# EAGLE design WW-11 (EAGLE 6.5.0)
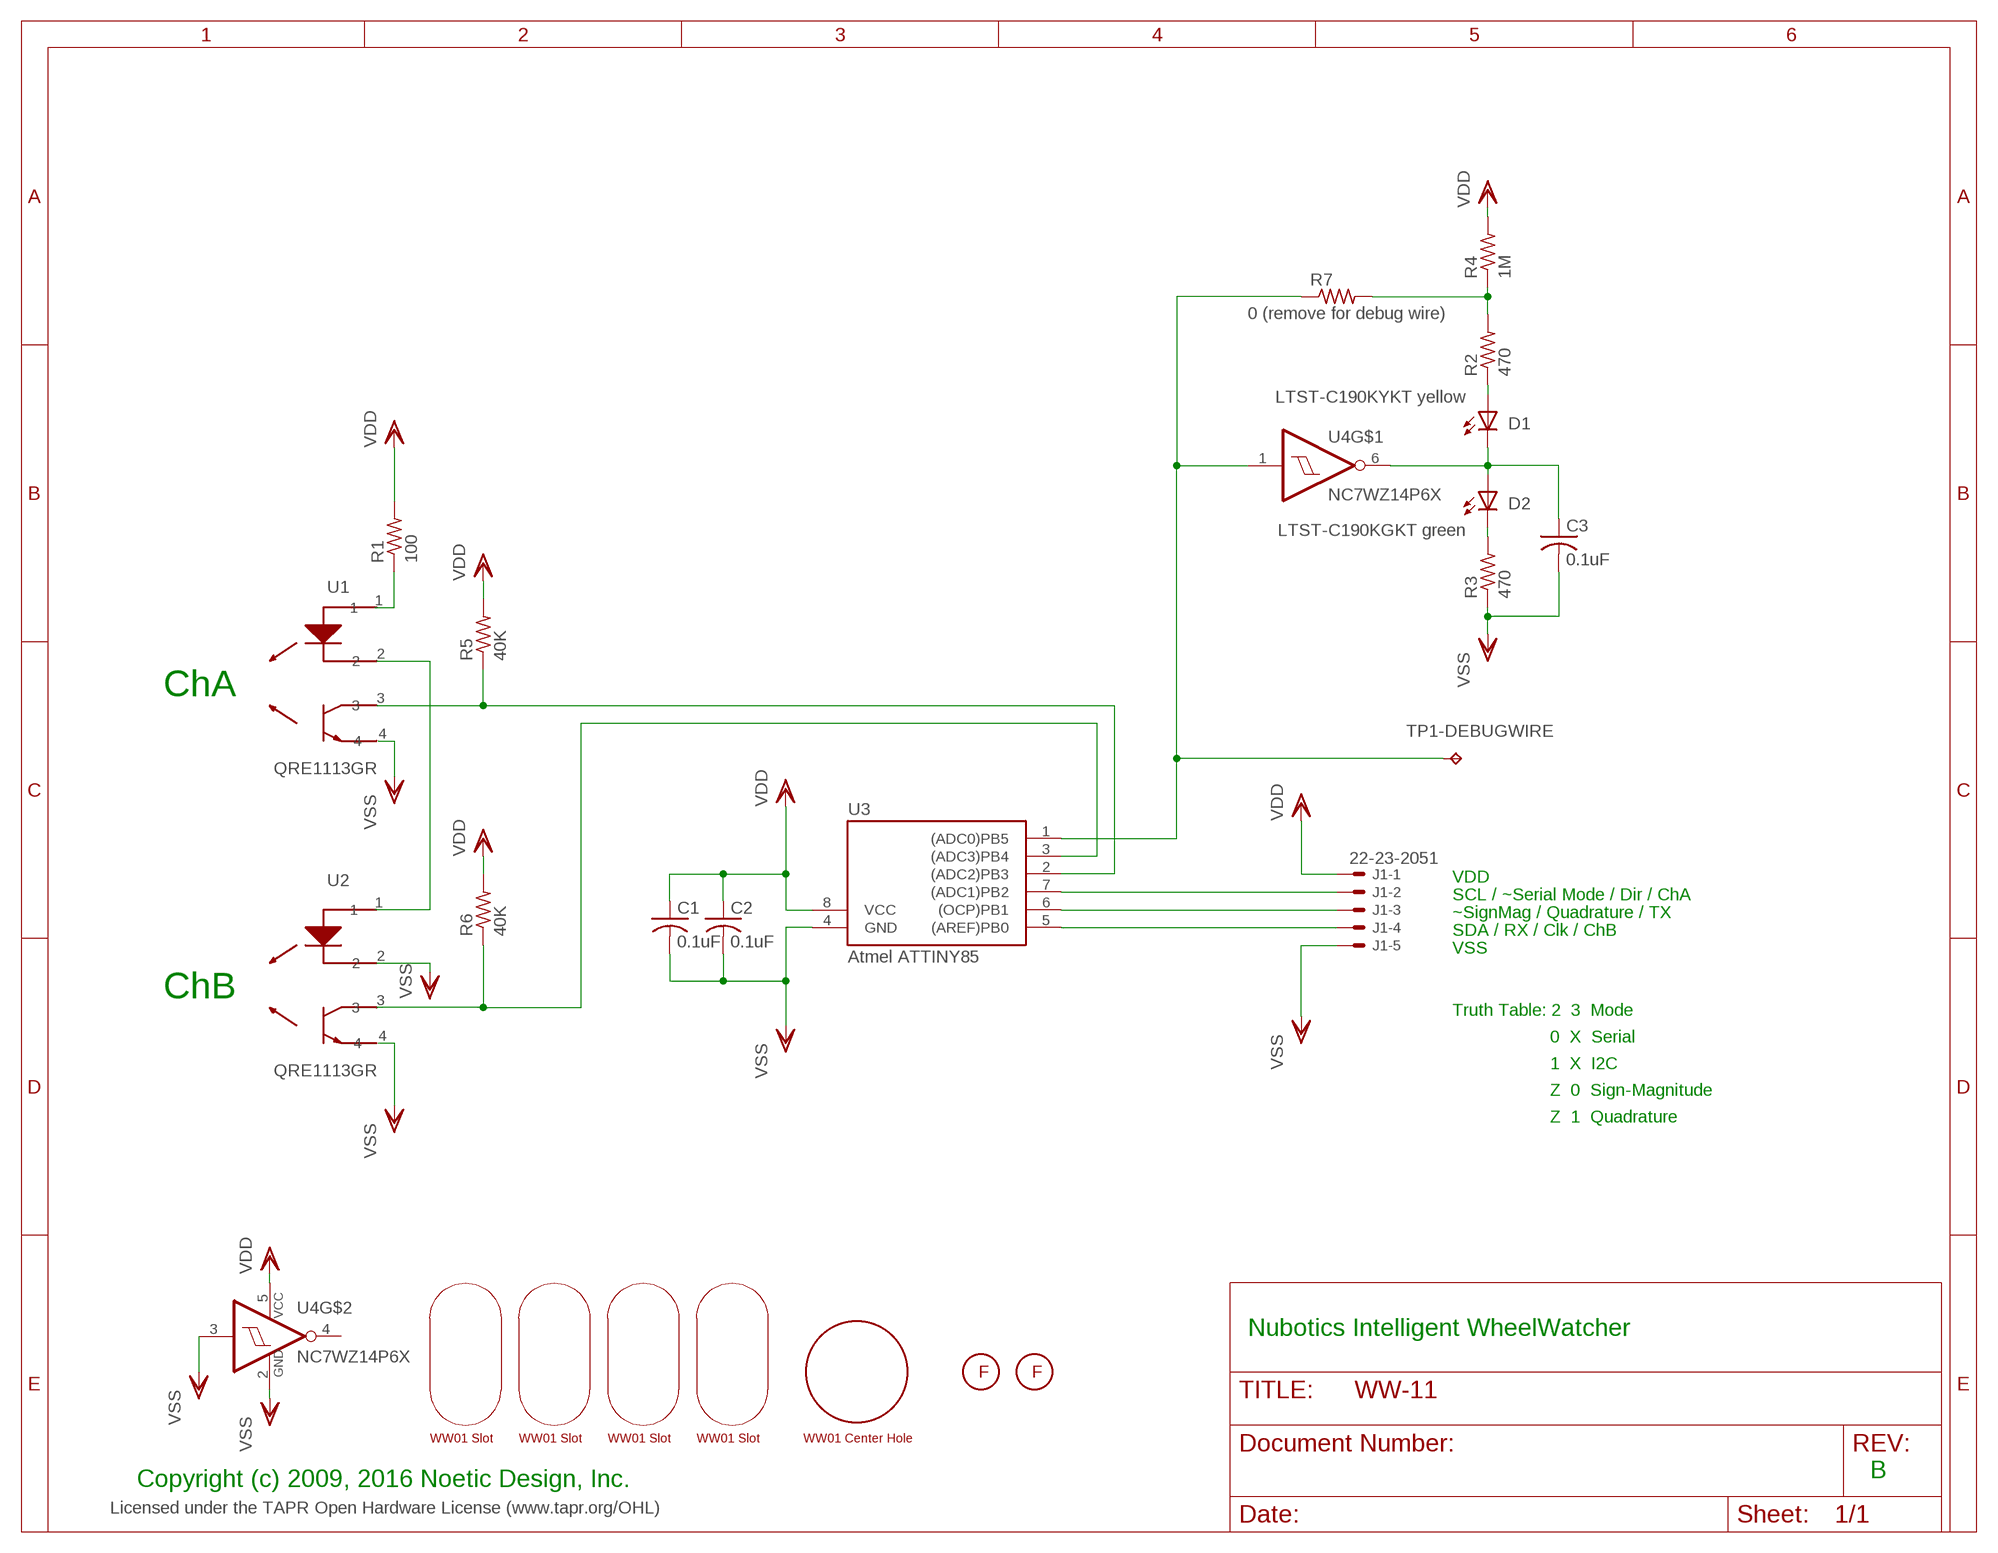
[diagram p0: schematic, sheet 1]

## Parts
C1  0.1uF  C-USC0603  [C0603]
C2  0.1uF  C-USC0603  [C0603]
C3  0.1uF  C-USC0603  [C0603]
D1  LTST-C190KYKT yellow  LEDCHIP-LED0603  [CHIP-LED0603]
D2  LTST-C190KGKT green  LEDCHIP-LED0603  [CHIP-LED0603]
FM1  FIDUCIAL2MMCIRCLE  [FIDUCIAL_2MMCIRCLE]
FM2  FIDUCIAL2MMCIRCLE  [FIDUCIAL_2MMCIRCLE]
J1  22-23-2051  [22-23-2051]
R1  100  R-US_R0603  [R0603]
R2  470  R-US_R0603  [R0603]
R3  470  R-US_R0603  [R0603]
R4  1M  R-US_R0603  [R0603]
R5  40K  R-US_R0603  [R0603]
R6  40K  R-US_R0603  [R0603]
R7  0 (remove for debug wire)  R-US_R0603  [R0603]
TP1-DEBUGWIRE  DEBUG WIRE  TPB1,27  [B1,27]
U1  QRE1113GR  [4TSOP]
U2  QRE1113GR  [4TSOP]
U3  Atmel ATTINY85  TINY85S  [SOIC8]
U4  NC7WZ14P6X  [SOT65P210X110-6AN_SC88_SC70-6]
U$1  WW-01SLOT  [WW01-SLOT]
U$2  WW-01SLOT  [WW01-SLOT]
U$3  WW-01SLOT  [WW01-SLOT]
U$4  WW-01SLOT  [WW01-SLOT]
U$5  WW01-CENTER  [WW01-CENTER]

## Nets
N$1: U1.2 U2.1
N$2: R1.1 U1.1
N$3: R5.1 U1.3 U3.2((ADC2)PB3)
N$4: R6.1 U2.3 U3.3((ADC3)PB4)
N$5: D1.A R2.1
N$6: C3.1 D1.C D2.A U4.6(O)
N$7: D2.C R3.2
N$9: R2.2 R4.1 R7.2
N$10: J1.2 U3.7((ADC1)PB2)
N$11: R7.1 TP1-DEBUGWIRE.PP(TP) U3.1((ADC0)PB5) U4.1(I)
N$12: J1.3 U3.6((OCP)PB1)
N$13: J1.4 U3.5((AREF)PB0)
VDD: C1.1 C2.1 J1.1 R1.2 R4.2 R5.2 R6.2 U3.8(VCC) U4.5(VCC)
VSS: C1.2 C2.2 C3.2 J1.5 R3.1 U1.4 U2.2 U2.4 U3.4(GND) U4.2(GND) U4.3(I)
Unconnected: U4.4(O)

## Notes on the sheet
- ChA
- VDD
- SCL / ~Serial Mode / Dir / ChA
- ~SignMag / Quadrature / TX
- SDA / RX / Clk / ChB
- VSS
- ChB
- Truth Table: 2  3  Mode
- 0  X  Serial
- 1  X  I2C
- Z  0  Sign-Magnitude
- Z  1  Quadrature
- Nubotics Intelligent WheelWatcher
- B
- Copyright (c) 2009, 2016 Noetic Design, Inc.
- Licensed under the TAPR Open Hardware License (www.tapr.org/OHL)

## Library data of the parts
C1 C2 = resistor:C-US: CAPACITOR, American symbol
C3 = rcl:C-US: CAPACITOR, American symbol
D1 D2 = led:LED: LED OSRAM: - CHIPLED LG R971, LG N971, LY N971, LG Q971, LY Q971, LO R971, LY R971 LH N974, LH R974 LS Q976, LO Q976, LY Q976 LO Q996 - Hyper CHIPLED LW Q18S LB Q993, LB Q99A, LB R99A - SideLED LS A670, LO A670, LY A670, LG A670, LP A670 LB A673, LV A673, LT A673, LW A673 LH A674 LY A675 LS A676, LA A676, LO A676, LY A676, LW A676 LS A679, LY A679, LG A679 - Hyper Micro SIDELED® LS Y876, LA Y876, LO Y876, LY Y876 LT Y87S - SmartLED LW L88C, LW L88S LB L89C, LB L89S, LG L890 LS L89K, LO L89K, LY L89K LS L896, LA L896, LO L896, LY L896 - TOPLED LS T670, LO T670, LY T670, LG T670, LP T670 LSG T670, LSP T670, LSY T670, LOP T670, LYG T670 LG T671, LOG T671, LSG T671 LB T673, LV T673, LT T673, LW T673 LH T674 LS T676, LA T676, LO T676, LY T676, LB T676, LH T676, LSB T676, LW T676 LB T67C, LV T67C, LT T67C, LS T67K, LO T67K, LY T67K, LW E67C LS E67B, LA E67B, LO E67B, LY E67B, LB E67C, LV E67C, LT E67C LW T67C LS T679, LY T679, LG T679 LS T770, LO T770, LY T770, LG T770, LP T770 LB T773, LV T773, LT T773, LW T773 LH T774 LS E675, LA E675, LY E675, LS T675 LS T776, LA T776, LO T776, LY T776, LB T776 LHGB T686 LT T68C, LB T68C - Hyper Mini TOPLED® LB M676 - Mini TOPLED Santana® LG M470 LS M47K, LO M47K, LY M47K Source: http://www.osram.convergy.de LUXEON: - LUMILED® LXK2-PW12-R00, LXK2-PW12-S00, LXK2-PW14-U00, LXK2-PW14-V00 LXK2-PM12-R00, LXK2-PM12-S00, LXK2-PM14-U00 LXK2-PE12-Q00, LXK2-PE12-R00, LXK2-PE12-S00, LXK2-PE14-T00, LXK2-PE14-U00 LXK2-PB12-K00, LXK2-PB12-L00, LXK2-PB12-M00, LXK2-PB14-N00, LXK2-PB14-P00, LXK2-PB14-Q00 LXK2-PR12-L00, LXK2-PR12-M00, LXK2-PR14-Q00, LXK2-PR14-R00 LXK2-PD12-Q00, LXK2-PD12-R00, LXK2-PD12-S00 LXK2-PH12-R00, LXK2-PH12-S00 LXK2-PL12-P00, LXK2-PL12-Q00, LXK2-PL12-R00 Source: www.luxeon.com KINGBRIGHT: KA-3528ASYC Source: www.kingbright.com
FM1 FM2 = pickplace:FIDUCIAL: Fiducial marks
J1 = con-molex:22-23-2051: .100" (2.54mm) Center Header - 5 Pin
R1-R3 R5 R6 = resistor:R-US_: RESISTOR, American symbol
R4 R7 = rcl:R-US_: RESISTOR, American symbol
TP1-DEBUGWIRE = testpad:TP: Test pad
U1 U2 = noetic:QRE1113GR: Fairchild Semiconductor QRE1113GR SMT Reflective Object Sensor Gull wing SMT 03-0261; PARTNUMBER: 03-0261
U3 = atmel:TINY85: MICROCONTROLLER 2.7-5.5 V 8 Kbytes FLASH 512 bytes EEPROM 512 bytes RAM 4-channel 10 bit ADC
U4 = fairchild-tinylogic:NC7W*14
U$1-U$4 = noetic:WW-01SLOT
U$5 = noetic:WW01-CENTER

## Net classes
0 default: width 0.203 mm, drill 0.203 mm, clearance 0.229 mm

## Board
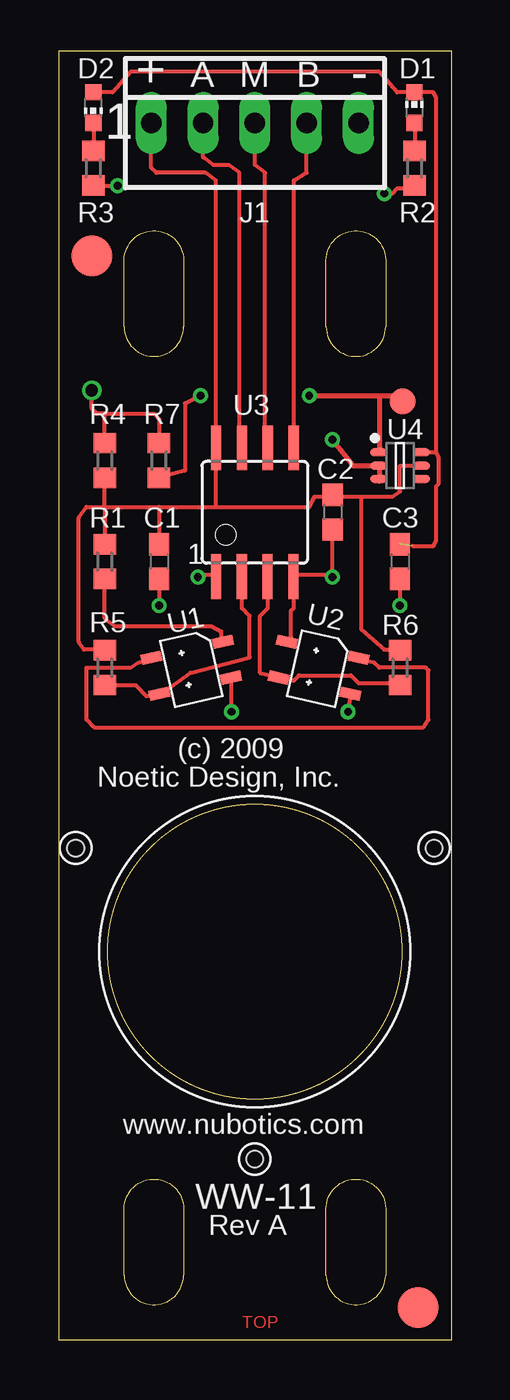
[diagram p1: board, top side]
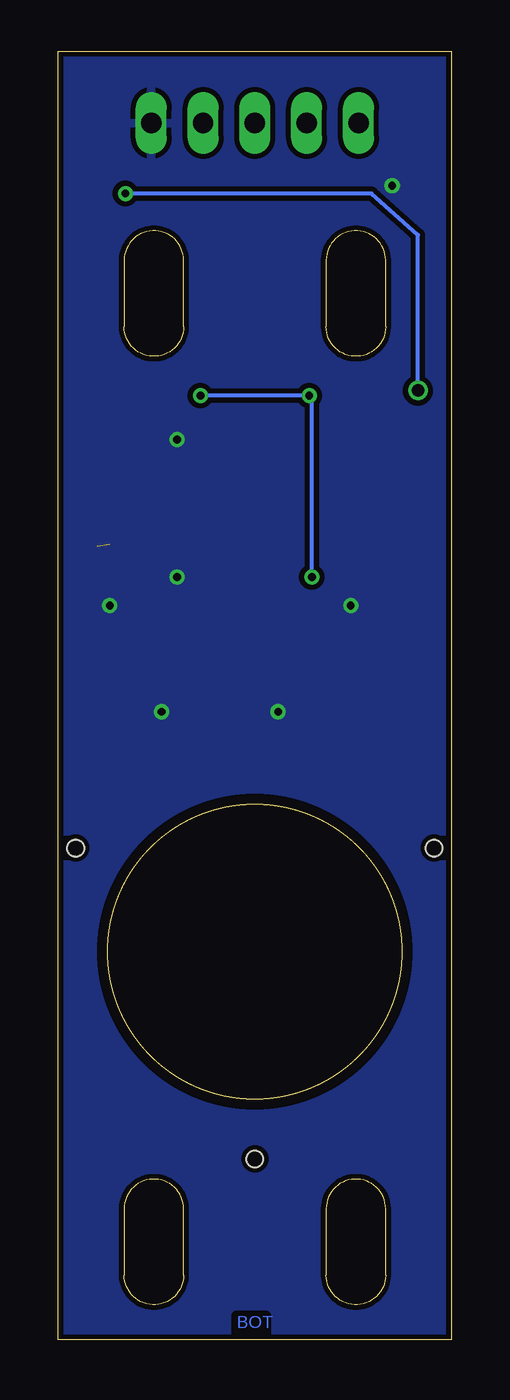
[diagram p2: board, bottom side, seen from below]

Size 19.28 x 63.17 mm. Coordinates in mm from the lower left corner, seen from the top.
Outline: 19.28,63.17 0,63.17 0,0 19.28,0 19.28,63.17
Copper layers (1*16): Top 0.035mm / dielectric 0.65mm / Bottom 0.035mm
Design rules "advCircuits7_2lyr_2": minimum track width 7mil, minimum drill 15mil, track to track 8mil, track to pad 8mil, pad to pad 8mil, via to via 8mil, smd to smd 8mil, copper to edge 10mil, drill to drill 8mil, minimum pad ring 10mil, minimum via ring 7mil, stop-mask expansion 2.5mil, vias tented up to drill 0mil, thermal gap 10mil
Holes 0.81 mm at 9.63,8.86 0.84,24.1 18.42,24.1

### Footprints (pad centres in the part's own frame; a part is rotated, then mirrored left to right if it is on the bottom)
C0603 = smd 1.1 x 1: 1 -0.85,0; 2 0.85,0
CHIP-LED0603 = smd 0.8 x 0.8: A 0,-0.75; C 0,0.75
FIDUCIAL_2MMCIRCLE = smd 2 x 2: P$1 0,0
22-23-2051 = drill 1 long: 1 -5.08,0; 2 -2.54,0; 3 0,0; 4 2.54,0; 5 5.08,0
R0603 = smd 1 x 1.1: 1 -0.85,0; 2 0.85,0
B1,27 = smd 1.27 x 1.27: PP 0,0
4TSOP = smd 1.016 x 0.508: 1 -1.8,-0.9; 2 1.8,-0.9; 3 1.8,0.9; 4 -1.8,0.9
SOIC8 = smd 0.5 x 2.2: 1 -1.905,-3.154; 2 -0.645,-3.154; 3 0.625,-3.154; 4 1.895,-3.154; 5 1.905,3.154; 6 0.635,3.154; 7 -0.635,3.154; 8 -1.905,3.154
SOT65P210X110-6AN_SC88_SC70-6 = smd 0.85 x 0.4: 1 -1.05,0.65; 2 -1.05,0; 3 -1.05,-0.65; 4 1.05,-0.65; 5 1.05,0; 6 1.05,0.65

### Placement (x,y rotation side)
C1  4.93,38.15 270 top
C2  13.44,40.56 270 top
C3  16.74,38.15 270 top
D1  17.46,60.4 0 top
D2  1.71,60.4 180 top
FM1  17.63,1.58 0 top
FM2  1.63,53.14 0 top
J1  9.63,59.64 0 top
R1  2.27,38.15 90 top
R2  17.46,57.43 270 top
R3  1.71,57.43 90 top
R4  2.27,43.1 270 top
R5  2.27,32.94 90 top
R6  16.74,32.94 90 top
R7  4.93,43.1 90 top
TP1-DEBUGWIRE  16.87,46 180 top
U1  6.51,32.94 192.7 top
U2  12.76,32.94 167.3 top
U3  9.63,40.56 0 top
U4  16.74,42.85 0 top
U$1  3.22,1.71 0 top
U$2  13.12,1.71 0 top
U$3  13.12,48.2 0 top
U$4  3.22,48.2 0 top
U$5  9.63,19.02 0 top

### Tracks (layer width: path | path; a pad name or v marks a point on that pad's centre or on a via)
N$1
  Top 0.203: U1.2 4.55,33.32 4.43,33.32 3.92,33.2 3.54,32.94 1.38,32.94 1.38,30.4 1.76,30.02 17.89,30.02 18.14,30.4 18.14,32.82 18.01,32.94 15.73,32.94 15.47,33.2 14.71,33.32 U2.1
N$2
  Top 0.203: U1.1 7.98,34.22 7.98,34.72 7.47,34.98 2.77,34.98 2.27,35.36 R1.1
N$3
  Top 0.203: R5.1 3.79,32.09 4.3,31.55 4.93,31.67 U1.3 5.06,31.67 6.46,32.69 9.38,33.45 9.38,35.48 9,35.87 9,37.39 U3.2
N$4
  Top 0.203: 11.03,32.44 9.89,32.69 9.89,35.48 10.27,35.87 10.27,37.39 U3.3 | 11.03,32.44 10.78,32.56 U2.3 10.9,32.44 11.03,32.44 | 11.03,32.44 11.54,32.31 11.79,32.56 14.33,32.56 14.71,32.18 16.74,32.18 R6.1
N$5
  Top 0.203: D1.A 17.51,59.61 17.51,58.09 R2.1
N$6  (1 unrouted)
  Top 0.203: D2.A 1.89,61.14 2.65,61.14 3.54,62.15 15.73,62.15 16.62,61.14 17.25,61.14 D1.C 17.51,61.14 18.39,61.14 18.52,60.88 18.52,43.48 | 17.89,43.48 U4.6 17.76,43.48 17.89,43.48 | 18.52,43.48 18.65,43.23 18.65,41.96 18.52,41.83 18.52,39.17 18.39,38.91 17.38,38.91 | 18.52,43.48 17.89,43.48
N$7
  Top 0.203: D2.C 1.76,59.61 1.76,58.34 R3.2
N$9  (via drill 0.38, 0.6)
  Top 0.203: 2.27,45.39 4.68,45.39 4.93,45.14 R7.2 | v15.98,56.18 16.36,56.18 16.62,56.44 17.38,56.44 R2.2 | v1.63,46.53 1.63,45.64 1.89,45.39 2.27,45.39 | R4.1 2.27,45.39
  Bottom 0.203: v15.98,56.18 3.92,56.18 1.63,54.15 v1.63,46.53
N$10
  Top 0.203: U3.7 9,43.74 8.87,44.37 8.87,57.2 8.36,57.58 7.6,57.58 7.09,57.96 J1.2
N$11  (via drill 0.38)
  Top 0.203: U4.1 15.6,43.48 | v6.97,46.28 6.2,45.9 6.2,42.6 R7.1 | v6.84,37.39 6.84,37.52 7.73,37.52 U3.1
  Top 0.254: v12.3,46.28 15.73,46.28 | 15.73,46.28 16.62,46.28 | 15.73,46.28 15.73,43.5
  Top 0.406: 16.62,46.28 TP1-DEBUGWIRE.PP | 15.73,43.5 U4.1
  Bottom 0.203: v12.3,46.28 v6.97,46.28 6.84,46.28 v6.84,37.39
N$12
  Top 0.203: 10.14,44.37 10.14,57.2 9.63,57.58 J1.3 | 10.14,44.37 10.14,44.63 | 10.14,44.37 10.14,43.74 10.27,43.74 U3.6
N$13
  Top 0.203: U3.5 11.54,56.82 12.17,57.2 J1.4
VDD
  Top 0.203: 13.44,41.33 12.55,41.33 12.3,40.82 7.73,40.82 | 2.27,40.82 1.38,40.82 1,40.31 1,34.21 1.25,33.83 2.27,33.83 R5.2 2.27,33.58 | 2.27,40.82 4.93,40.82 | 4.93,40.82 C1.1 | 4.93,40.82 7.73,40.82 | 7.73,40.82 U3.8 7.73,56.82 7.22,57.2 4.81,57.2 4.55,57.46 J1.1 | 2.27,40.82 R4.2 | 2.27,40.82 R1.2 | 13.44,41.33 14.84,41.33 | 14.84,41.33 16.36,41.33 16.74,41.58 16.74,42.85 U4.5 | 13.44,41.33 C2.1 | 14.84,41.33 14.84,34.85 15.98,33.83 17.12,33.83 R6.2
VSS  (via drill 0.38)
  Top 0.203: U2.2 11.28,34.34 11.41,34.47 11.41,35.74 11.54,35.87 11.54,37.39 U3.4 11.54,37.52 13.44,37.52 | 13.44,37.52 13.51,37.32 v13.44,37.39 | 13.44,37.52 C2.2 | v14.2,30.78 14.33,31.55 U2.4 | v8.49,30.78 8.49,32.44 8.36,32.56 U1.4 | C1.2 v4.93,35.99 | v2.9,56.57 1.76,56.57 R3.1 | 15.73,42.09 U4.3 15.73,42.21 15.73,42.85 U4.2 | C3.2 v16.74,35.99
  Top 0.254: 15.73,42.09 15.73,42.85 14.46,42.85 v13.44,44.12
  pour Bottom (isolate 0.254): -0.02,63.17 19.28,63.17 19.28,-0.08 -0.02,-0.08

### Text on the board
Top: TOP
Bottom: BOT
tPlace: 1 | 1 | (c) 2009 | Noetic Design, Inc. | www.nubotics.com | WW-11 | Rev A
tNames: + | A | M | B | -
Document: Licensed under the TAPR Open Hardware License (www.tapr.org/OHL)